# EAGLE design op-synth 2018-05-09 (EAGLE 9.0.1)
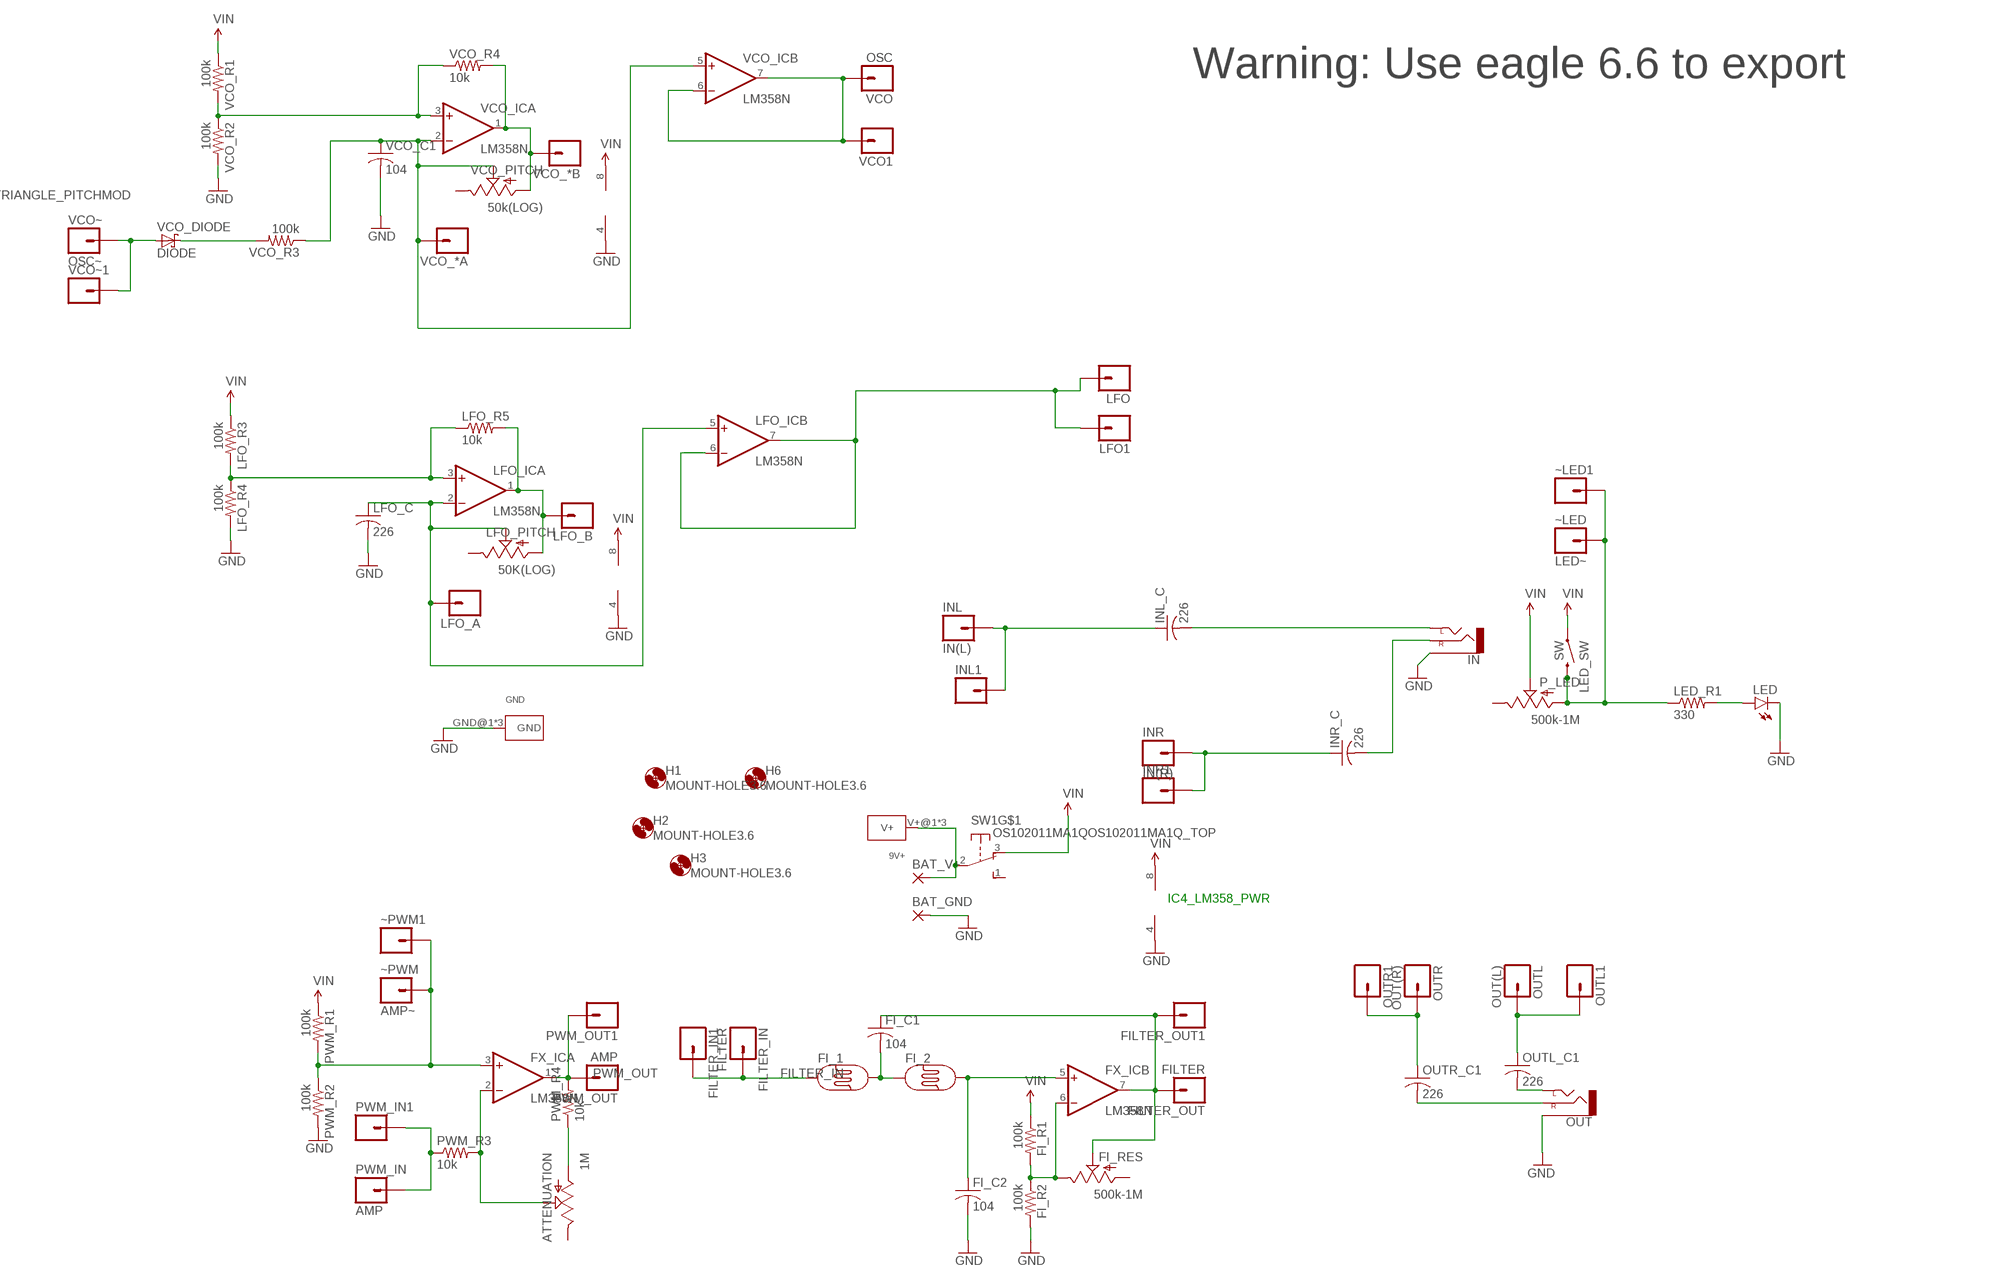
[diagram p0: schematic, sheet 1]

## Parts
9V+  KEYSTONE-629+  [KEYSTONE_BATTAERY_TERMINAL-629+]
ATTENUATION  1M  POTTRIM  [TRIM_POT]
BAT_GND  3,81/1,4  [3,81/1,4]
BAT_V+  3,81/1,4  [3,81/1,4]
FI_1  PHOTOCELLPTH  [PHOTOCELL]
FI_2  PHOTOCELLPTH  [PHOTOCELL]
FI_C1  104  C-US050-024X044  [C050-024X044]
FI_C2  104  C-US050-024X044  [C050-024X044]
FI_R1  100k  R-US_0204/7  [0204/7]
FI_R2  100k  R-US_0204/7  [0204/7]
FI_RES  500k-1M  POT  [ALPS_POT]
FILTER_IN  FILTER  HEADER-1X1  [1X01_SIDE_NAME]
FILTER_IN1  HEADER-1X1  [1X01_SIDE_NAME]
FILTER_OUT  FILTER  HEADER-1X1  [1X01_SIDE_NAME]
FILTER_OUT1  HEADER-1X1  [1X01_SIDE_NAME]
FX_IC  LM358N  [DIL08]
GND  KEYSTONE-629  [KEYSTONE_AA_AAA_BATTERY_TERMINAL-629]
H1  MOUNT-HOLE3.6  [3,6]
H2  MOUNT-HOLE3.6  [3,6]
H3  MOUNT-HOLE3.6  [3,6]
H6  MOUNT-HOLE3.6  [3,6]
IN  AUDIO-JACKPTH  [AUDIO-JACK]
INL  IN(L)  HEADER-1X1  [1X01_SIDE_NAME]
INL1  HEADER-1X1  [1X01_SIDE_NAME]
INL_C  226  C-US050-024X044  [C050-024X044]
INR  IN(R)  HEADER-1X1  [1X01_SIDE_NAME]
INR1  HEADER-1X1  [1X01_SIDE_NAME]
INR_C  226  C-US050-024X044  [C050-024X044]
LED  LED5MM  [LED5MM]
LED_R1  330  R-US_0204/7  [0204/7]
LED_SW  SW  SWITCH-MOMENTARY-212MM  [TACTILE-PTH-12MM]
LFO  HEADER-1X1  [1X01_SIDE_NAME]
LFO1  HEADER-1X1  [1X01_SIDE_NAME]
LFO_A  HEADER-1X1  [1X01_SIDE_NAME]
LFO_B  HEADER-1X1  [1X01_SIDE_NAME]
LFO_C  226  C-US050-024X044  [C050-024X044]
LFO_IC  LM358N  [DIL08]
LFO_PITCH  50K(LOG)  POT  [ALPS_POT]
LFO_R3  100k  R-US_0204/7  [0204/7]
LFO_R4  100k  R-US_0204/7  [0204/7]
LFO_R5  10k  R-US_0204/7  [0204/7]
OUT  AUDIO-JACKPTH  [AUDIO-JACK]
OUTL  OUT(L)  HEADER-1X1  [1X01_SIDE_NAME]
OUTL1  HEADER-1X1  [1X01_SIDE_NAME]
OUTL_C1  226  C-US050-024X044  [C050-024X044]
OUTR  OUT(R)  HEADER-1X1  [1X01_SIDE_NAME]
OUTR1  HEADER-1X1  [1X01_SIDE_NAME]
OUTR_C1  226  C-US050-024X044  [C050-024X044]
P_LED  500k-1M  POT  [ALPS_POT]
PWM_IN  AMP  HEADER-1X1  [1X01_SIDE_NAME]
PWM_IN1  HEADER-1X1  [1X01_SIDE_NAME]
PWM_OUT  AMP  HEADER-1X1  [1X01_SIDE_NAME]
PWM_OUT1  HEADER-1X1  [1X01_SIDE_NAME]
PWM_R1  100k  R-US_0204/7  [0204/7]
PWM_R2  100k  R-US_0204/7  [0204/7]
PWM_R3  10k  R-US_0204/7  [0204/7]
PWM_R4  10k  R-US_0204/7  [0204/7]
SW1  OS102011MA1QOS102011MA1Q_TOP  [OS102011MA1Q]
VCO  OSC  HEADER-1X1  [1X01_SIDE_NAME]
VCO1  HEADER-1X1  [1X01_SIDE_NAME]
VCO_*A  HEADER-1X1  [1X01_SIDE_NAME]
VCO_*B  HEADER-1X1  [1X01_SIDE_NAME]
VCO_C1  104  C-US050-024X044  [C050-024X044]
VCO_DIODE  DIODE  SCHOTTKY-DIODEDO41-7  [DO41-7]
VCO_IC  LM358N  [DIL08]
VCO_PITCH  50k(LOG)  POT  [ALPS_POT]
VCO_R1  100k  R-US_0204/7  [0204/7]
VCO_R2  100k  R-US_0204/7  [0204/7]
VCO_R3  100k  R-US_0204/7  [0204/7]
VCO_R4  10k  R-US_0204/7  [0204/7]
VCO~  OSC~  HEADER-1X1  [1X01_SIDE_NAME]
VCO~1  HEADER-1X1  [1X01_SIDE_NAME]
~LED  LED~  HEADER-1X1  [1X01_SIDE_NAME]
~LED1  HEADER-1X1  [1X01_SIDE_NAME]
~PWM  AMP~  HEADER-1X1  [1X01_SIDE_NAME]
~PWM1  HEADER-1X1  [1X01_SIDE_NAME]

## Nets
FILTER_IN: FI_1.1 FILTER_IN1.1 FILTER_IN.1
FILTER_OUT: FI_C1.1 FI_RES.P$2(S) FILTER_OUT1.1 FILTER_OUT.1 FX_IC.7(B:OUT)
GND: BAT_GND.1(P) FI_C2.2 FI_R2.2 FX_IC.4(P:V-) GND.GND@1(GND) GND.GND@2(GND) GND.GND@3(GND) IN.SLEEVE LED.K(C) LFO_C.2 LFO_IC.4(P:V-) LFO_R4.2 OUT.SLEEVE PWM_R2.2 VCO_C1.2 VCO_IC.4(P:V-) VCO_R2.2
LFO: LFO1.1 LFO.1 LFO_IC.6(B:-IN) LFO_IC.7(B:OUT)
MOD_IN: PWM_IN1.1 PWM_IN.1 PWM_R3.1
N$1: 9V+.V+@1(V+) 9V+.V+@2(V+) 9V+.V+@3(V+) BAT_V+.1(P) SW1.2(P)
N$2: VCO_DIODE.C VCO_R3.2
N$3: ATTENUATION.1(S) FX_IC.2(A:-IN) PWM_R3.2
N$4: VCO_IC.3(A:+IN) VCO_R1.2 VCO_R2.1 VCO_R4.1
N$5: ATTENUATION.3(A) PWM_R4.1
N$6: LED.A LED_R1.2
N$7: FI_2.2 FI_C2.1 FX_IC.5(B:+IN)
N$8: FI_1.2 FI_2.1 FI_C1.2
N$9: OUTR1.1 OUTR.1 OUTR_C1.1
N$10: VCO_*B.1 VCO_IC.1(A:OUT) VCO_PITCH.P$3(A) VCO_R4.2
N$11: OUT.TIP(LEFT) OUTL_C1.2
N$12: OUTL1.1 OUTL.1 OUTL_C1.1
N$13: LED_R1.1 LED_SW.3 P_LED.P$3(A) ~LED1.1 ~LED.1
N$14: INR1.1 INR.1 INR_C.1
N$15: IN.RING(RIGHT) INR_C.2
N$16: FI_R1.2 FI_R2.1 FI_RES.P$1(E) FX_IC.6(B:-IN)
N$17: LFO_IC.3(A:+IN) LFO_R3.2 LFO_R4.1 LFO_R5.1
N$18: VCO_*A.1 VCO_C1.1 VCO_IC.2(A:-IN) VCO_IC.5(B:+IN) VCO_PITCH.P$2(S) VCO_R3.1
N$19: INL1.1 INL.1 INL_C.1
N$20: IN.TIP(LEFT) INL_C.2
N$21: LFO_B.1 LFO_IC.1(A:OUT) LFO_PITCH.P$3(A) LFO_R5.2
N$22: LFO_A.1 LFO_C.1 LFO_IC.2(A:-IN) LFO_IC.5(B:+IN) LFO_PITCH.P$2(S)
N$23: VCO1.1 VCO.1 VCO_IC.6(B:-IN) VCO_IC.7(B:OUT)
N$24: OUT.RING(RIGHT) OUTR_C1.2
N$25: FX_IC.3(A:+IN) PWM_R1.2 PWM_R2.1 ~PWM1.1 ~PWM.1
PWM_OUT: FX_IC.1(A:OUT) PWM_OUT1.1 PWM_OUT.1 PWM_R4.2
TRIANGLE_PITCHMOD: VCO_DIODE.A VCO~1.1 VCO~.1
VIN: FI_R1.1 FX_IC.8(P:V+) LED_SW.1 LFO_IC.8(P:V+) LFO_R3.1 P_LED.P$2(S) PWM_R1.1 SW1.3(O) VCO_IC.8(P:V+) VCO_R1.1
Unconnected: ATTENUATION.2(E) FI_RES.P$3(A) LFO_PITCH.P$1(E) P_LED.P$1(E) SW1.1(S) SW1.MT1(MT) SW1.MT2(MT) VCO_PITCH.P$1(E)

## Notes on the sheet
- Warning: Use eagle 6.6 to export
- IC4_LM358_PWR

## Library data of the parts
9V+ = kanflo:KEYSTONE-629+
ATTENUATION = SparkFun-Electromechanical:POT
BAT_GND BAT_V+ = wirepad:3,81/1,4: THROUGH-HOLE PAD
FI_1 FI_2 = SparkFun-Sensors:PHOTOCELL: CdS photoresistor. This is a low cost way to detect light levels. Resistance decreases with more incoming light. SparkFun SKU: SEN-09088
FI_C1 FI_C2 LFO_C = resistor:C-US: CAPACITOR, American symbol
FI_R1 FI_R2 LED_R1 LFO_R3-LFO_R5 PWM_R1-PWM_R4 VCO_R1-VCO_R4 = resistor:R-US_: RESISTOR, American symbol
FI_RES LFO_PITCH P_LED VCO_PITCH = SparkFun-Electromechanical:POT; PROD_ID: RES-09177
FILTER_IN FILTER_IN1 FILTER_OUT FILTER_OUT1 INL INL1 INR INR1 LFO LFO1 LFO_A LFO_B OUTL OUTL1 OUTR OUTR1 PWM_IN PWM_IN1 PWM_OUT PWM_OUT1 VCO VCO1 VCO_*A VCO_*B VCO~ VCO~1 ~LED ~LED1 ~PWM ~PWM1 = TOF:HEADER-1X1: Header 1 Standard 1-pin 0.1" header. Use with straight break away headers (SKU : PRT-00116), right angle break away headers (PRT-00553), swiss pins (PRT-00743), machine pins (PRT-00117), and female headers (PRT-00115).
FX_IC LFO_IC VCO_IC = linear:LM358: OP AMP also LM158; LM258; LM2904 Source: http://cache.national.com/ds/LM/LM158.pdf
GND = kanflo:KEYSTONE-629: Keystone 629 PCB Mount Battery Contact for 1 (AA), 1 (AAA), 1 (N), Coil Spring Contact Links Data sheet <http://docs-europe.electrocomponents.com/webdocs/002e/0900766b8002ef6f.pdf> RS Online <http://se.rs-online.com/web/p/battery-holders-mounts/2050057/>
H1-H3 H6 = holes:MOUNT-HOLE: MOUNTING HOLE with drill center marker
IN OUT = SparkFun-Connectors:AUDIO-JACK: 3.5mm Audio Jack Simple 3.5mm common PCB mount audio jack. Variant PTH is our storefront SKU PRT-08032
INL_C INR_C OUTL_C1 OUTR_C1 VCO_C1 = adafruit:C-US: CAPACITOR, American symbol
LED = SparkFun-LED:LED: LEDs Standard schematic elements and footprints for 5mm, 3mm, 1206, and 0603 sized LEDs. 5mm - Spark Fun Electronics SKU : COM-00529 (and others)
LED_SW = SparkFun-Electromechanical:SWITCH-MOMENTARY-2: Various NO switches- pushbuttons, reed, etc; PROD_ID: SWCH-09185
SW1 = TOF:OS102011MA1Q: OS10201MA1Q through-hole right angle switch http://www.ladyada.net/library/eagle
VCO_DIODE = adafruit:SCHOTTKY-DIODE: Schottky Diode

## Board
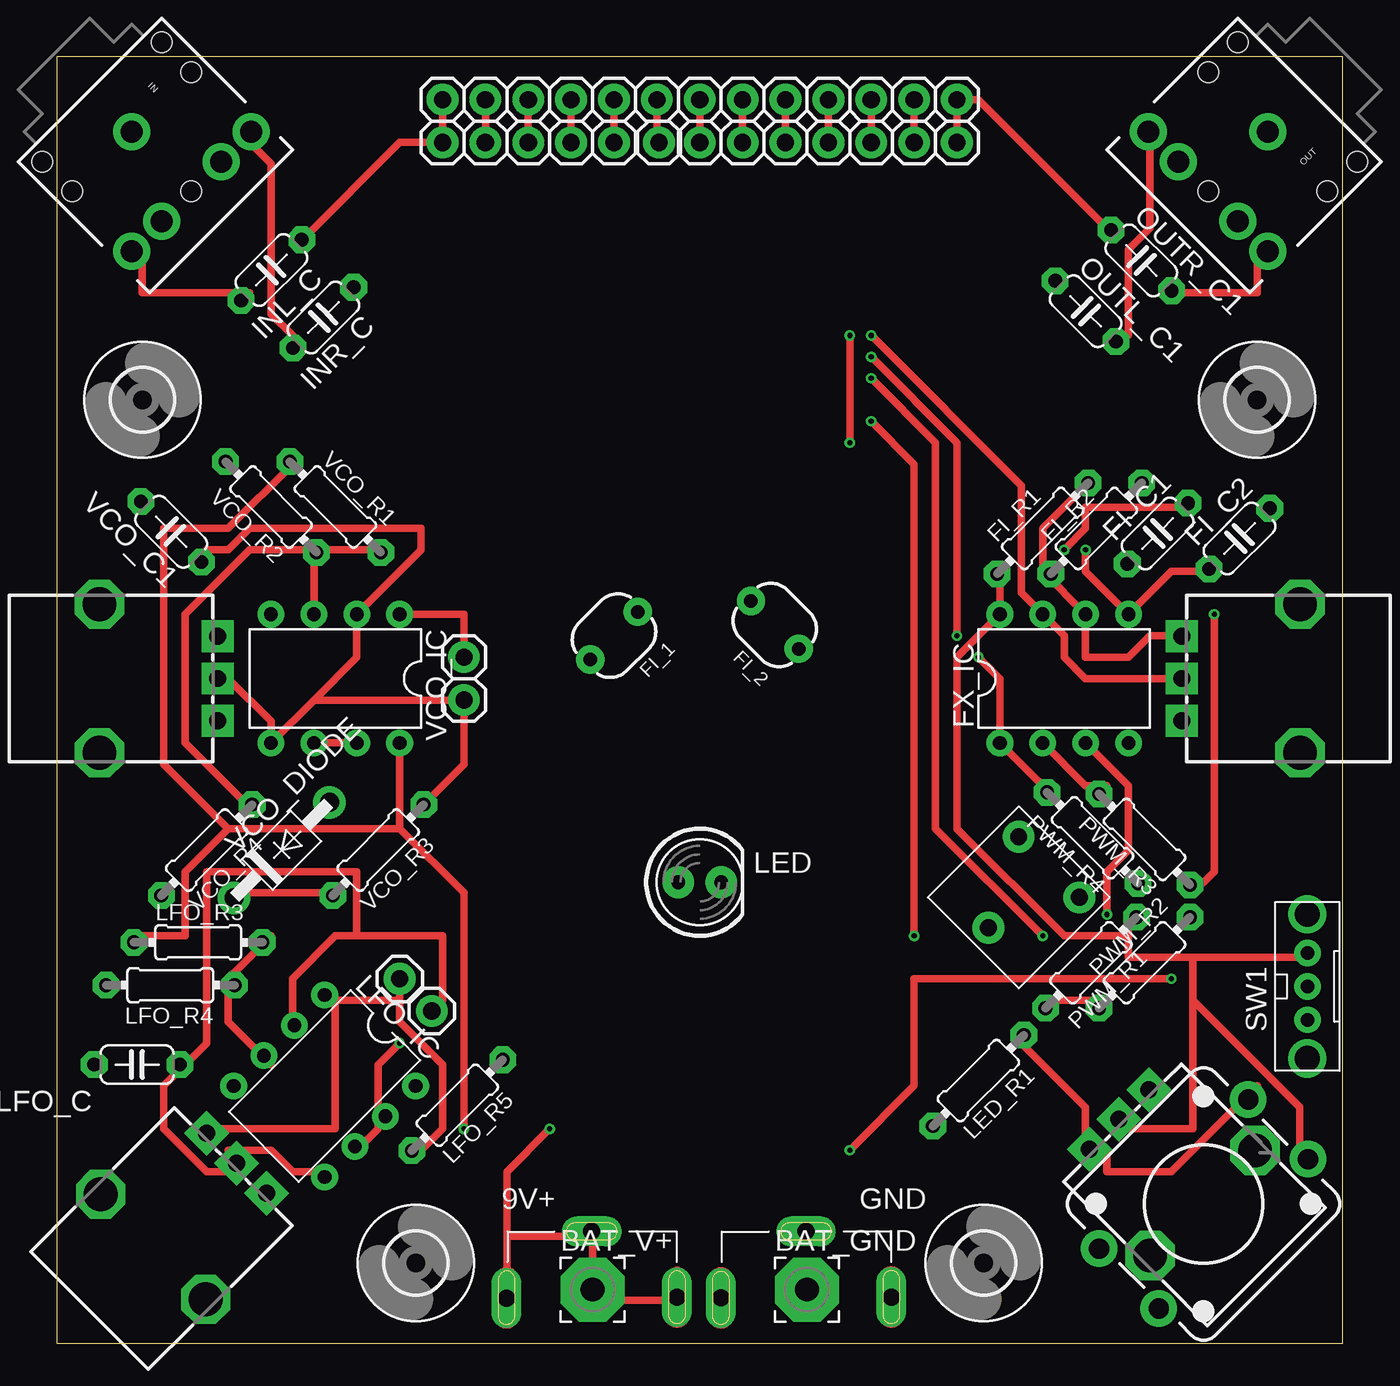
[diagram p1: board, top side]
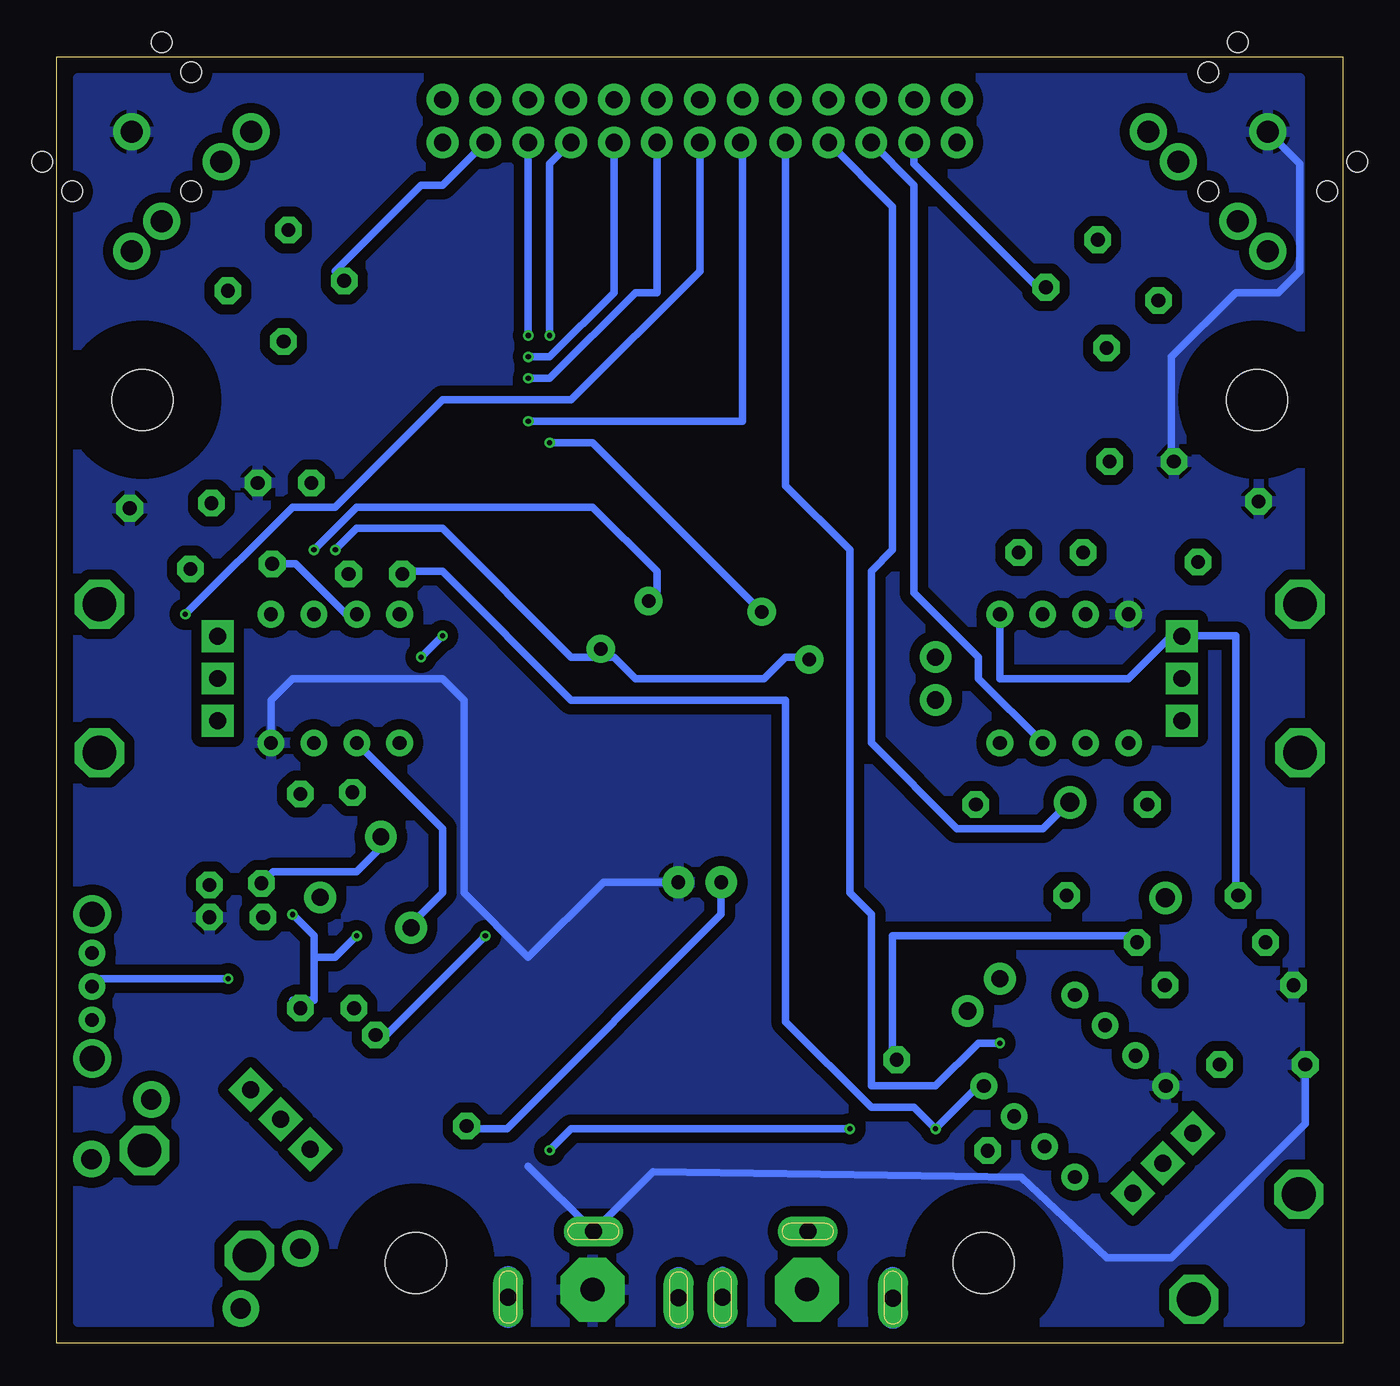
[diagram p2: board, bottom side, seen from below]

Size 76.2 x 76.2 mm. Coordinates in mm from the lower left corner, seen from the top.
Outline: 0,0 76.2,0 76.2,76.2 0,76.2 0,0
Copper layers (1*16): Top 0.035mm / dielectric 1.5mm / Bottom 0.035mm
Design rules "EagleRules *": minimum track width 18mil, minimum drill 12mil, track to track 7mil, track to pad 12mil, pad to pad 12mil, via to via 7mil, smd to smd 0mil, copper to edge 25mil, drill to drill 10mil, minimum pad ring 15mil, minimum via ring 6mil, stop-mask expansion 2mil, vias tented up to drill 25mil, thermal gap 10mil
tRestrict: area 21.6,61 to 54.6,69.8; area 30.5,7.6 to 45.7,61; area 26.7,27.9 to 49.5,40.6

### Footprints (pad centres in the part's own frame; a part is rotated, then mirrored left to right if it is on the bottom)
KEYSTONE_BATTAERY_TERMINAL-629+ = drill 1 pad 1.5 long: V+@1 5,-0.449; V+@2 -0.05,3.45; V+@3 -5.1,-0.499
TRIM_POT = drill 1 pad 1.88: 1 5.08,0; 2 0,2.54; 3 0,-2.54
3,81/1,4 = drill 1.397 pad 3.81 octagon: 1 0,0
PHOTOCELL = drill 0.8 pad 1.676: 1 -2,0; 2 2,0
C050-024X044 = drill 0.813 octagon: 1 -2.54,0; 2 2.54,0
0204/7 = drill 0.813 octagon: 1 -3.81,0; 2 3.81,0
ALPS_POT = drill 1 pad 1.88 square: P$1 7,-2.5; P$2 7,0; P$3 7,2.5 | drill 2 octagon: P$4 0,-4.4; P$5 0,4.4
1X01_SIDE_NAME = drill 1.016 pad 1.88: 1 0,0
DIL08 = drill 0.813 pad 1.27: 1 -3.81,-3.81; 2 -1.27,-3.81; 3 1.27,-3.81; 4 3.81,-3.81; 5 3.81,3.81; 6 1.27,3.81; 7 -1.27,3.81; 8 -3.81,3.81
KEYSTONE_AA_AAA_BATTERY_TERMINAL-629 = drill 1 pad 1.5 long: GND@1 5,-0.436; GND@2 -0.05,3.45; GND@3 -5.1,-0.486
3,6 = hole 3.6: 0,0
AUDIO-JACK = drill 1.3 pad 2.184: RING 5,5; RSH 5,2.5; SLEEVE 0,0; TIP 5,-5; TSH 5,-2.5 | hole 1.2: 0,5; -2.5,5; -2.5,-5; 0,-5; 5,0
LED5MM = drill 0.813 pad 1.88: A -1.27,0; K 1.27,0
TACTILE-PTH-12MM = drill 1.2 pad 2.159: 1 6.25,-2.5; 2 -6.25,-2.5; 3 6.25,2.5; 4 -6.25,2.5
OS102011MA1Q = drill 0.8 pad 1.422: 1 -1.981,0; 2 0,0; 3 1.981,0 | drill 1.5 pad 2.184: MT1 -4.267,0; MT2 4.267,0
DO41-7 = drill 1.118 pad 1.93: A 4,0; C -4,0

### Placement (x,y rotation side)
9V+  31.75,3.17 0 top
ATTENUATION  58.79,28.2 225 top
BAT_GND  44.45,3.17 0 top
BAT_V+  31.75,3.17 0 top
FI_1  33.02,41.91 225 top
FI_2  42.55,42.55 135 top
FI_C1  65.23,47.96 45 top
FI_C2  70.08,47.66 45 top
FI_R1  58.42,48.26 45 top
FI_R2  61.59,48.26 45 top
FI_RES  73.66,39.37 180 top
FILTER_IN  45.72,71.12 270 top
FILTER_IN1  45.72,73.66 90 top
FILTER_OUT  48.26,71.12 270 top
FILTER_OUT1  48.26,73.66 90 top
FX_IC  59.69,39.37 0 top
GND  44.45,3.17 0 top
H1  71.12,55.88 0 top
H2  21.27,4.76 0 top
H3  54.93,4.76 0 top
H6  5.08,55.88 0 top
IN  4.45,71.75 315 top
INL  22.86,71.12 270 top
INL1  22.86,73.66 90 top
INL_C  12.72,63.56 225 top
INR  25.4,71.12 270 top
INR1  25.4,73.66 90 top
INR_C  15.8,60.75 225 top
LED  38.1,27.3 0 top
LED_R1  54.61,15.56 225 top
LED_SW  67.94,8.26 45 top
LFO  33.02,71.12 270 top
LFO1  33.02,73.66 0 top
LFO_A  22.23,19.68 45 top
LFO_B  20.32,21.59 315 top
LFO_C  4.76,16.51 180 top
LFO_IC  15.88,15.24 225 top
LFO_PITCH  5.71,5.71 45 top
LFO_R3  8.38,23.75 0 top
LFO_R4  6.73,21.21 180 top
LFO_R5  23.74,14.1 225 top
OUT  71.75,71.75 225 top
OUTL  50.8,71.12 270 top
OUTL1  50.8,73.66 90 top
OUTL_C1  60.96,61.13 315 top
OUTR  53.34,71.12 270 top
OUTR1  53.34,73.66 90 top
OUTR_C1  64.26,64.13 315 top
P_LED  67.89,8.31 135 top
PWM_IN  38.1,71.12 270 top
PWM_IN1  38.1,73.66 90 top
PWM_OUT  43.18,71.12 270 top
PWM_OUT1  43.18,73.66 90 top
PWM_R1  61.28,22.54 225 top
PWM_R2  64.45,22.54 45 top
PWM_R3  64.45,29.84 135 top
PWM_R4  61.37,29.94 135 top
SW1  74.1,21.14 90 top
VCO  27.94,71.12 270 top
VCO1  27.94,73.66 90 top
VCO_*A  24.13,38.1 0 top
VCO_*B  24.13,40.64 270 top
VCO_C1  6.78,48.07 135 top
VCO_DIODE  13.34,29.21 45 top
VCO_IC  16.51,39.37 180 top
VCO_PITCH  2.54,39.37 0 top
VCO_R1  16.51,49.53 315 top
VCO_R2  12.7,49.53 135 top
VCO_R3  19.05,29.21 225 top
VCO_R4  8.89,29.21 225 top
VCO~  30.48,71.12 270 top
VCO~1  30.48,73.66 90 top
~LED  35.69,71.12 270 top
~LED1  35.56,73.66 90 top
~PWM  40.64,71.12 270 top
~PWM1  40.64,73.66 90 top

### Tracks (layer width: path | path; a pad name or v marks a point on that pad's centre or on a via)
FILTER_IN  (via drill 0.3)
  Top 0.457: v46.99,59.69 v46.99,53.34 | FILTER_IN.1 FILTER_IN1.1
  Bottom 0.457: v46.99,53.34 44.45,53.34 FI_1.1 34.29,43.18 | v46.99,59.69 46.99,69.85 FILTER_IN.1
FILTER_OUT  (via drill 0.3)
  Top 0.457: FILTER_OUT1.1 FILTER_OUT.1 | FI_RES.P$2 60.96,39.37 59.69,40.64 59.69,41.91 FX_IC.7 57.15,44.45 57.15,50.8 v48.26,59.69
  Bottom 0.457: v48.26,59.69 FILTER_OUT.1 | FI_C1.1 62.04,46.16 59.05,43.18 FX_IC.7
GND
  Bottom 0.457: LED.K 43.81,27.3 48.26,22.86 52.07,26.67 52.07,38.1 53.34,39.37 62.23,39.37 63.5,38.1 FX_IC.4 | 48.26,10.48 GND.GND@2 40.87,10.16 19.05,9.84 13.97,5.08 10.16,5.08 2.22,13.02 LFO_C.2 | IN.SLEEVE 2.54,69.85 2.54,63.5 3.81,62.23 6.35,62.23 10.16,58.42 10.16,52.38 VCO_R2.2
  pour Bottom (isolate 0.61): 2.54,74.93 74.93,74.93 74.93,1.27 2.54,1.27
LFO  (via drill 0.3)
  Top 0.457: LFO.1 LFO1.1 | 19.05,13.97 19.05,12.7 17.78,11.43 LFO_IC.6 | v20.32,17.78 19.05,16.51 19.05,13.97 | 19.05,13.97 LFO_IC.7
  Bottom 0.457: LFO.1 33.02,50.8 29.21,46.99 29.21,26.67 27.94,25.4 27.94,15.24 24.13,15.24 21.59,17.78 v20.32,17.78
MOD_IN  (via drill 0.3)
  Top 0.457: v68.58,43.18 68.58,27.94 67.31,26.67 PWM_R3.1 | PWM_IN.1 PWM_IN1.1
  Bottom 0.457: v68.58,43.18 62.23,49.53 59.69,49.53 53.34,55.88 45.72,55.88 38.1,63.5 PWM_IN.1
N$1  (via drill 0.3)
  Top 0.457: 9V+.V+@1 36.83,2.54 31.75,2.54 BAT_V+.1 31.75,6.35 9V+.V+@2 30.48,6.35 26.67,6.35 | v66.04,21.59 50.8,21.59 50.8,15.24 v46.99,11.43 | v29.21,12.7 26.67,10.16 26.67,6.35 | 26.67,6.35 26.67,3.81 9V+.V+@3
  Bottom 0.457: v66.04,21.59 73.66,21.59 SW1.2 | v46.99,11.43 45.72,12.7 v29.21,12.7
N$2
  Top 0.457: VCO_R3.2 16.51,26.67 11.43,26.67 VCO_DIODE.C
N$3
  Top 0.457: FX_IC.2 60.96,33.02 62.23,33.02 PWM_R3.2
  Bottom 0.457: ATTENUATION.1 55.2,24.81 53.34,26.67 53.34,30.48 FX_IC.2
N$4
  Top 0.457: 15.24,46.99 11.43,46.99 7.62,43.18 7.62,35.56 11.43,31.75 VCO_R4.1 | 15.24,46.99 VCO_IC.3 | 15.24,46.99 19.05,46.99 VCO_R1.2 | 15.24,46.99 VCO_R2.1
N$5
  Bottom 0.457: ATTENUATION.3 57,29.36 58.42,27.94 63.37,27.94 PWM_R4.1
N$6
  Bottom 0.457: LED.A 36.83,25.4 49.53,12.7 51.75,12.7 LED_R1.2
N$7  (via drill 0.3)
  Top 0.457: FI_C2.1 68.58,45.72 66.04,45.72 FX_IC.5 60.96,45.72 v60.96,46.99
  Bottom 0.457: v60.96,46.99 58.42,49.53 44.45,49.53 40.64,45.72 40.64,44.45 FI_2.2
N$8  (via drill 0.3)
  Top 0.457: v59.69,46.99 60.96,48.26 60.96,49.53 67.31,49.53 FI_C1.2
  Bottom 0.457: v59.69,46.99 58.42,48.26 53.34,48.26 45.72,40.64 44.45,40.64 | 44.45,40.64 43.18,40.64 41.91,39.37 34.29,39.37 33.02,40.64 31.75,40.64 FI_1.2 | 44.45,40.64 FI_2.1
N$9
  Top 0.457: OUTR_C1.1 62.23,66.04 54.61,73.66 OUTR1.1 OUTR.1
N$10
  Top 0.457: VCO_IC.1 24.13,43.18 VCO_*B.1
  Bottom 0.457: VCO_R4.2 6.35,26.67 6.35,41.91 8.89,41.91 VCO_PITCH.P$3 10.16,41.91 12.7,39.37 20.32,39.37 VCO_IC.1
N$11
  Top 0.457: OUTL_C1.2 63.5,59.69 63.5,64.77 64.77,66.04 64.77,71.12 OUT.TIP
N$12
  Top 0.457: OUTL.1 OUTL1.1
  Bottom 0.457: OUTL.1 53.34,68.58 54.61,68.58 59.69,63.5 OUTL_C1.1
N$13  (via drill 0.3)
  Top 0.457: ~LED1.1 35.56,71.12 ~LED.1 | 71.12,15.24 LED_SW.3 69.85,13.97 66.04,10.16 62.23,10.16 62.23,11.43 P_LED.P$3 60.96,11.43 60.96,13.97 57.15,17.78 LED_R1.1 | v48.26,54.61 50.8,52.07 v50.8,24.13
  Bottom 0.457: v48.26,54.61 35.56,54.61 35.56,71.12 ~LED.1 | v50.8,24.13 57.15,17.78 LED_R1.1
N$14
  Top 0.457: INR.1 INR1.1
  Bottom 0.457: INR.1 25.4,69.85 17.78,62.23 INR_C.1
N$15
  Top 0.457: INR_C.2 13.97,59.69 12.7,60.96 12.7,69.85 11.43,71.12 IN.RING
N$16
  Top 0.457: 58.42,45.72 FX_IC.6 60.96,40.64 63.5,40.64 64.77,41.91 66.04,41.91 FI_RES.P$1 | FI_R1.2 58.42,48.26 58.42,45.72 | 58.42,45.72 FI_R2.1
N$17
  Top 0.457: 10.16,21.59 12.7,24.13 LFO_R3.2 | 10.16,21.59 10.16,19.05 12.7,16.51 LFO_IC.3 | 10.16,21.59 LFO_R4.1
  Bottom 0.457: LFO_R5.1 26.67,16.51 26.67,24.13 12.7,24.13 LFO_R3.2
N$18
  Top 0.457: 21.59,31.75 VCO_R3.1 24.13,34.29 VCO_*A.1 15.24,38.1 | VCO_C1.1 8.89,46.99 10.16,46.99 11.43,48.26 21.59,48.26 21.59,46.99 VCO_IC.2 17.78,40.64 15.24,38.1 | 15.24,38.1 VCO_IC.5 12.7,36.83 10.16,39.37 VCO_PITCH.P$2
N$19
  Top 0.457: INL_C.1 14.56,65.36 20.32,71.12 INL.1 INL1.1
N$20
  Top 0.457: INL_C.2 11.43,62.23 5.08,62.23 5.08,64.77 IN.TIP
N$21
  Top 0.457: LFO_B.1 20.32,20.32 | 20.32,20.32 20.32,19.05 22.86,16.51 22.86,12.7 21.59,11.43 LFO_R5.2 | 20.32,20.32 16.51,20.32 | 16.51,20.32 16.51,12.7 8.89,12.7 LFO_PITCH.P$3 | 16.51,20.32 LFO_IC.1
N$22
  Top 0.457: 17.78,24.13 22.86,24.13 22.86,20.32 LFO_A.1 | 17.78,24.13 16.51,24.13 13.97,21.59 13.97,19.05 LFO_IC.2 | LFO_IC.5 15.24,10.16 13.97,10.16 12.7,11.43 10.16,11.43 LFO_PITCH.P$2 10.16,10.16 8.89,10.16 6.35,12.7 6.35,15.24 7.62,16.51 | 17.78,24.13 17.78,27.94 8.89,27.94 8.89,17.78 7.62,16.51 | 7.62,16.51 LFO_C.1
N$23
  Top 0.457: VCO_IC.7 VCO_IC.6 | VCO1.1 VCO.1
  Bottom 0.457: VCO_IC.7 21.59,39.37 21.59,40.64 25.4,44.45 25.4,68.58 VCO.1
N$24
  Top 0.457: OUTR_C1.2 66.04,62.23 71.12,62.23 71.12,64.77 OUT.RING
N$25  (via drill 0.3)
  Top 0.457: ~PWM1.1 ~PWM.1 | PWM_R1.2 58.42,20.32 62.23,20.32 PWM_R2.1 | FX_IC.3 63.5,33.02 63.5,29.21 62.23,27.94 v62.23,25.4 | v48.26,57.15 52.07,53.34 52.07,30.48 v58.42,24.13
  Bottom 0.457: v62.23,25.4 60.96,24.13 60.96,22.86 | 60.96,22.86 60.96,20.32 62.23,20.32 PWM_R2.1 | ~PWM.1 40.64,62.23 41.91,62.23 46.99,57.15 v48.26,57.15 | v58.42,24.13 59.69,22.86 60.96,22.86
PWM_OUT  (via drill 0.3)
  Top 0.457: PWM_OUT1.1 PWM_OUT.1 | PWM_R4.2 58.42,33.02 FX_IC.1 55.88,39.37 v54.61,40.64 | v48.26,58.42 53.34,53.34 v53.34,41.91
  Bottom 0.457: PWM_OUT.1 43.18,62.23 46.99,58.42 v48.26,58.42 | v54.61,40.64 v53.34,41.91
TRIANGLE_PITCHMOD
  Top 0.457: VCO~1.1 VCO~.1
  Bottom 0.457: VCO~.1 26.67,67.31 26.67,46.99 27.94,45.72 27.94,35.56 22.86,30.48 17.78,30.48 16.51,31.75 VCO_DIODE.A
VIN  (via drill 0.3)
  Top 0.457: 10.16,30.48 7.62,27.94 7.62,24.13 5.08,24.13 LFO_R3.1 | 20.32,30.48 10.16,30.48 | VCO_IC.8 20.32,30.48 | v24.13,12.7 24.13,26.67 20.32,30.48 | 10.16,30.48 6.35,34.29 6.35,48.26 10.16,48.26 13.97,52.07 VCO_R1.1 | FI_R1.1 55.88,45.72 FX_IC.8 53.34,40.64 53.34,30.48 59.69,24.13 63.5,24.13 | 67.31,22.86 63.5,22.86 63.5,24.13 | 67.31,22.86 73.66,22.86 SW1.3 | 63.5,24.13 63.5,25.4 PWM_R1.1 | 67.31,22.86 67.31,20.32 | 67.31,20.32 67.31,12.7 63.5,12.7 P_LED.P$2 | 67.31,20.32 73.66,13.97 73.66,11.43 LED_SW.1
  Bottom 0.457: LFO_IC.8 21.59,15.24 v24.13,12.7 25.4,13.97 27.94,13.97 33.02,19.05 33.02,38.1 45.72,38.1 53.34,45.72 55.88,45.72 FI_R1.1

### Text on the board
tValues: IN | OUT | OP-SYNTH / 2018-05-09 | 50K | 500k | OSC | Q | + | - | GAIN | POWER | LED | 500k OR / BUTTON | 50K | LFO
bValues: circuit : thomas o fredericks / illustration : denis raby / op-synth.tofstuff.com | 9V battery | 9V+ | GND
Reference: Use eagle 6.6 to export!